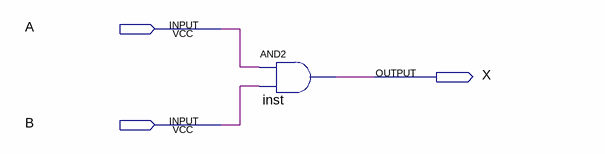
[diagram p0: schematic sheet]
// Quartus schematic porta_and.bdf as structural Verilog: 1 symbols, 3 pins
module porta_and (
  input  A,
  input  B,
  output X
);

  and inst (X, A, B);
endmodule
